# Altium schematic sheet Main.SchDoc
size A4; SheetNumber: 1; SheetTotal: 1
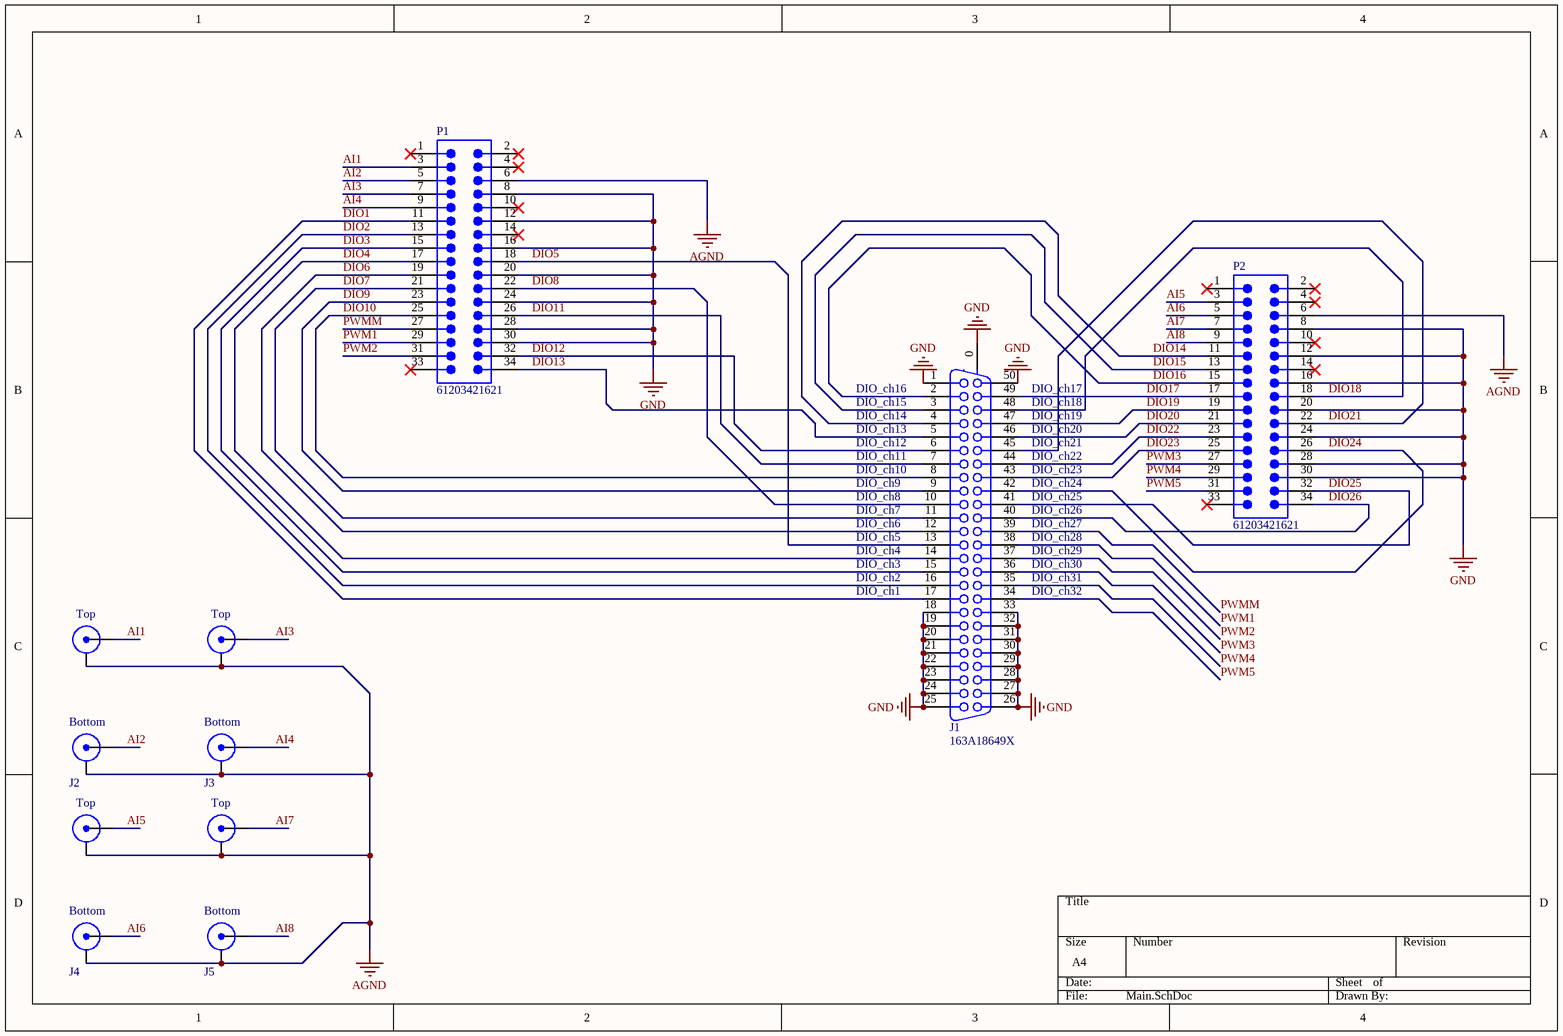
[diagram p0: Main.SchDoc]

## Parts
J1  163A18649X  [CON D STD 50Way Male RA]
J2  CON BNC Dual B  [BNC_INS90_Dual]  (value not drawn)
J3  CON BNC Dual B  [BNC_INS90_Dual]  (value not drawn)
J4  CON BNC Dual B  [BNC_INS90_Dual]  (value not drawn)
J5  CON BNC Dual B  [BNC_INS90_Dual]  (value not drawn)
P1  61203421621  [61203421621]
P2  61203421621  [61203421621]

## Nets
AGND: J2.2 J2.4 J3.2 J3.4 J4.2 J4.4 J5.2 J5.4 P1.6 P2.6
GND: J1.0(MH1) J1.1 J1.18 J1.19 J1.20 J1.21 J1.22 J1.23 J1.24 J1.25 J1.26 J1.27 J1.28 J1.29 J1.30 J1.31 J1.32 J1.33 J1.50 P1.8 P1.12 P1.16 P1.20 P1.24 P1.28 P1.30 P2.8 P2.12 P2.16 P2.20 P2.24 P2.28 P2.30
AI1: J2.3 P1.3
AI2: J2.1 P1.5
AI3: J3.3 P1.7
AI4: J3.1 P1.9
AI5: J4.3 P2.3
AI6: J4.1 P2.5
AI7: J5.3 P2.7
AI8: J5.1 P2.9
DIO1: J1.17 P1.11
DIO2: J1.16 P1.13
DIO3: J1.15 P1.15
DIO4: J1.14 P1.17
DIO5: J1.13 P1.18
DIO6: J1.12 P1.19
DIO7: J1.11 P1.21
DIO8: J1.10 P1.22
DIO9: J1.9 P1.23
DIO10: J1.8 P1.25
DIO11: J1.7 P1.26
DIO12: J1.6 P1.32
DIO13: J1.5 P1.34
DIO14: J1.4 P2.11
DIO15: J1.3 P2.13
DIO16: J1.2 P2.15
DIO17: J1.49 P2.17
DIO18: J1.48 P2.18
DIO19: J1.47 P2.19
DIO20: J1.46 P2.21
DIO21: J1.45 P2.22
DIO22: J1.44 P2.23
DIO23: J1.43 P2.25
DIO24: J1.42 P2.26
DIO25: J1.41 P2.32
DIO26: J1.40 P2.34
PWM1: J1.38 P1.29
PWM2: J1.37 P1.31
PWM3: J1.36 P2.27
PWM4: J1.35 P2.29
PWM5: J1.34 P2.31
PWMM: J1.39 P1.27

Not connected (* = marked no-connect by the designer): P1 1* 2* 4* 10* 14* 33*; P2 1* 2* 4* 10* 14* 33*

## Notes on the sheet
- (near J1) DIO_ch12
- (near J1) DIO_ch13
- (near J1) DIO_ch14
- (near J1) DIO_ch15
- (near J1) DIO_ch16
- (near J1) DIO_ch17
- (near J1) DIO_ch18
- (near J1) DIO_ch19
- (near J1) DIO_ch20
- (near J1) DIO_ch21
- (near J1) DIO_ch7
- (near J1) DIO_ch8
- (near J1) DIO_ch9
- (near J1) DIO_ch10
- (near J1) DIO_ch11
- (near J1) DIO_ch22
- (near J1) DIO_ch23
- (near J1) DIO_ch24
- (near J1) DIO_ch25
- (near J1) DIO_ch26
- (near J1) DIO_ch2
- (near J1) DIO_ch3
- (near J1) DIO_ch4
- (near J1) DIO_ch5
- (near J1) DIO_ch6
- (near J1) DIO_ch27
- (near J1) DIO_ch28
- (near J1) DIO_ch29
- (near J1) DIO_ch30
- (near J1) DIO_ch31
- (near J1) DIO_ch1
- (near J1) DIO_ch32
- (in symbol CON BNC Dual B) Top; Bottom

## Library data of the parts
J1 = CON DSUB50 RA Male: 50 Position D-Sub Plug, Male Pins Connector; Positions: 50; Orientation: Right Angle; Digi-Key: 626-2184-ND; Manufacturer Part Number: 163A18649X
J2-J5 = CON BNC Dual B: BNC Dual - Black; Manufacturer Code: 031-6575; Manufacturer: Amphenol; Digikey Order: ARF2111-ND
P1 P2 = CMP-1502-00013-2: NexarPartId: 32855483; Row Spacing: 2.54mm; Number of Contacts: 34; Connector Type: Male Pin; Insulation Resistance: 1GΩ; Gender: Male; Operating Supply Voltage: 250V; Current Rating: 3A; Contact Resistance: 20mΩ; Mount: Through Hole; Contact Plating: Gold; Contact Material: Copper; Color: Black; Lead Pitch: 2.54mm; Lead Free: Lead Free; Number of Positions: 34; Insulation Material: PBT; Max Operating Temperature: 105°C; REACH SVHC: Unknown; RoHS: Compliant; Length: 50.84mm; Pitch: 2.54mm; Number of Pins: 34; Min Operating Temperature: -40°C; Number of Rows: 2; Termination: Solder; Orientation: Vertical